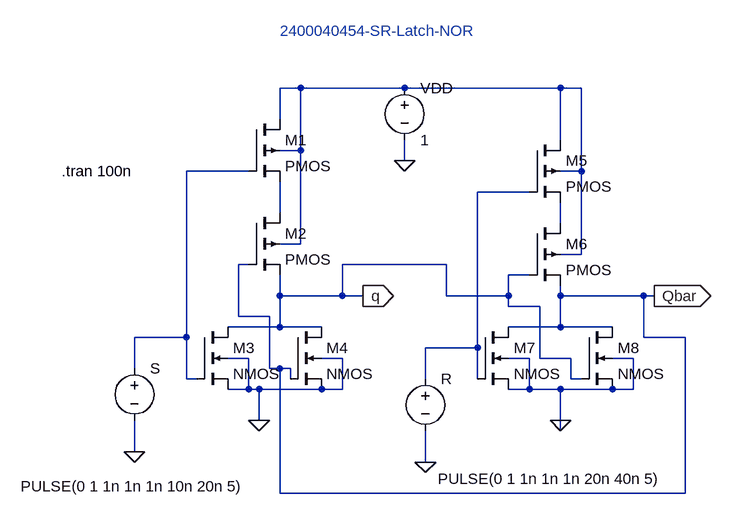
[diagram p0: schematic 2400040454-3.asc]
2400040454-3.asc, the LTspice schematic file:
Version 4.1
SHEET 1 880 680
WIRE 80 -32 48 -32
WIRE 240 -32 80 -32
WIRE 480 -32 240 -32
WIRE 512 -32 480 -32
WIRE 48 16 48 -32
WIRE 480 48 480 -32
WIRE 80 64 80 -32
WIRE 80 64 48 64
WIRE 240 80 240 48
WIRE 0 96 -96 96
WIRE 512 96 512 -32
WIRE 512 96 480 96
WIRE 432 128 352 128
WIRE 48 160 48 112
WIRE 480 176 480 144
WIRE 80 208 80 64
WIRE 80 208 48 208
WIRE 512 224 512 96
WIRE 512 224 480 224
WIRE 0 240 -16 240
WIRE 304 240 144 240
WIRE 432 256 400 256
WIRE 48 288 48 256
WIRE 144 288 144 240
WIRE 144 288 48 288
WIRE 176 288 144 288
WIRE 304 288 304 240
WIRE 400 288 400 256
WIRE 400 288 304 288
WIRE 480 288 480 272
WIRE 608 288 480 288
WIRE 624 288 608 288
WIRE 400 304 400 288
WIRE 448 304 400 304
WIRE -16 320 -16 240
WIRE 32 320 -16 320
WIRE 48 336 48 288
WIRE 48 336 -32 336
WIRE 112 336 48 336
WIRE 480 336 480 288
WIRE 480 336 400 336
WIRE 560 336 480 336
WIRE -96 352 -96 96
WIRE -96 352 -176 352
WIRE 608 352 608 288
WIRE 672 352 608 352
WIRE 352 368 352 128
WIRE 352 368 272 368
WIRE 0 384 -32 384
WIRE 144 384 112 384
WIRE 432 384 400 384
WIRE 448 384 448 304
WIRE 496 384 448 384
WIRE 592 384 560 384
WIRE -176 400 -176 352
WIRE 32 400 32 320
WIRE 48 400 32 400
WIRE 64 400 48 400
WIRE -96 416 -96 352
WIRE -80 416 -96 416
WIRE 64 416 64 400
WIRE 272 416 272 368
WIRE 352 416 352 368
WIRE 496 416 496 384
WIRE 512 416 496 416
WIRE 0 432 0 384
WIRE 0 432 -32 432
WIRE 16 432 0 432
WIRE 112 432 16 432
WIRE 144 432 144 384
WIRE 144 432 112 432
WIRE 432 432 432 384
WIRE 432 432 400 432
WIRE 480 432 432 432
WIRE 560 432 480 432
WIRE 592 432 592 384
WIRE 592 432 560 432
WIRE 16 480 16 432
WIRE 480 480 480 432
WIRE 480 496 480 480
WIRE -176 528 -176 480
WIRE 272 544 272 496
WIRE 48 592 48 400
WIRE 672 592 672 352
WIRE 672 592 48 592
FLAG 16 480 0
FLAG 480 480 0
FLAG -176 528 0
FLAG 272 544 0
FLAG 240 80 0
FLAG 176 288 q
IOPIN 176 288 Out
FLAG 624 288 Qbar
IOPIN 624 288 Out
SYMBOL pmos4 0 16 R0
SYMATTR InstName M1
SYMBOL pmos4 0 160 R0
SYMATTR InstName M2
SYMBOL nmos4 -80 336 R0
SYMATTR InstName M3
SYMBOL nmos4 64 336 R0
SYMATTR InstName M4
SYMBOL pmos4 432 48 R0
SYMATTR InstName M5
SYMBOL pmos4 432 176 R0
SYMATTR InstName M6
SYMBOL nmos4 352 336 R0
SYMATTR InstName M7
SYMBOL nmos4 512 336 R0
SYMATTR InstName M8
SYMBOL voltage 272 400 R0
WINDOW 3 19 170 Left 2
WINDOW 123 0 0 Left 0
WINDOW 39 0 0 Left 0
SYMATTR Value PULSE(0 1 1n 1n 1n 20n 40n 5)
SYMATTR InstName R
SYMBOL voltage -176 384 R0
WINDOW 3 -175 197 Left 2
WINDOW 123 0 0 Left 0
WINDOW 39 0 0 Left 0
SYMATTR Value PULSE(0 1 1n 1n 1n 10n 20n 5)
SYMATTR InstName S
SYMBOL voltage 240 -48 R0
SYMATTR InstName VDD
SYMATTR Value 1
TEXT -288 96 Left 2 !.tran 100n
TEXT 48 -120 Left 2 ;2400040454-SR-Latch-NOR

The netlist it stands for:
* 2400040454-3.asc
M1 N001 N002 N004 N001 PMOS
M2 N004 Qbar q N001 PMOS
M3 q N002 0 0 NMOS
M4 q Qbar 0 0 NMOS
M5 N001 N003 N005 N001 PMOS
M6 N005 q Qbar N001 PMOS
M7 Qbar N003 0 0 NMOS
M8 Qbar q 0 0 NMOS
V§R N003 0 PULSE(0 1 1n 1n 1n 20n 40n 5)
V§S N002 0 PULSE(0 1 1n 1n 1n 10n 20n 5)
VDD N001 0 1
.model NMOS NMOS
.model PMOS PMOS
.lib standard.mos
.tran 100n
* 2400040454-SR-Latch-NOR
.backanno
.end